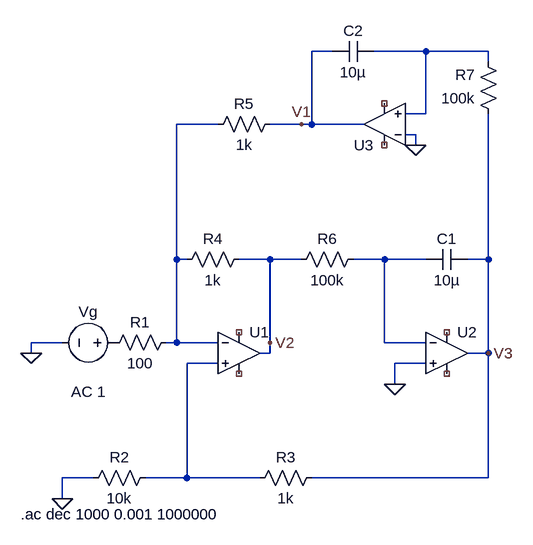
[diagram p0: schematic Draft2.asc]
Draft2.asc, the LTspice schematic file:
Version 4.1
SHEET 1 948 680
WIRE 432 -320 400 -320
WIRE 576 -320 496 -320
WIRE 672 -320 576 -320
WIRE 672 -304 672 -320
WIRE 576 -224 576 -320
WIRE 576 -224 544 -224
WIRE 256 -208 192 -208
WIRE 384 -208 336 -208
WIRE 400 -208 400 -320
WIRE 400 -208 384 -208
WIRE 480 -208 400 -208
WIRE 560 -192 544 -192
WIRE 560 -176 560 -192
WIRE 192 0 192 -208
WIRE 208 0 192 0
WIRE 336 0 288 0
WIRE 384 0 336 0
WIRE 512 0 464 0
WIRE 576 0 512 0
WIRE 672 0 672 -224
WIRE 672 0 640 0
WIRE 16 128 -32 128
WIRE 192 128 192 0
WIRE 192 128 176 128
WIRE 256 128 192 128
WIRE 336 128 336 0
WIRE 512 128 512 0
WIRE 576 128 512 128
WIRE -32 144 -32 128
WIRE 336 144 336 128
WIRE 336 144 320 144
WIRE 672 144 672 0
WIRE 672 144 640 144
WIRE 256 160 208 160
WIRE 576 160 528 160
WIRE 528 192 528 160
WIRE 64 336 16 336
WIRE 208 336 208 160
WIRE 208 336 144 336
WIRE 320 336 208 336
WIRE 672 336 672 144
WIRE 672 336 400 336
WIRE 16 368 16 336
FLAG -32 144 0
FLAG 16 368 0
FLAG 528 192 0
FLAG 560 -176 0
FLAG 384 -208 V1
FLAG 336 128 V2
FLAG 672 144 V3
SYMBOL voltage 112 128 R90
WINDOW 0 -32 56 VBottom 2
WINDOW 3 32 56 VTop 2
WINDOW 123 60 56 VTop 2
WINDOW 39 0 0 Left 0
SYMATTR InstName Vg
SYMATTR Value ""
SYMATTR Value2 AC 1
SYMBOL res 192 112 R90
WINDOW 0 0 56 VBottom 2
WINDOW 3 32 56 VTop 2
SYMATTR InstName R1
SYMATTR Value 100
SYMBOL res 160 320 R90
WINDOW 0 0 56 VBottom 2
WINDOW 3 32 56 VTop 2
SYMATTR InstName R2
SYMATTR Value 10k
SYMBOL res 416 320 R90
WINDOW 0 0 56 VBottom 2
WINDOW 3 32 56 VTop 2
SYMATTR InstName R3
SYMATTR Value 1k
SYMBOL res 304 -16 R90
WINDOW 0 0 56 VBottom 2
WINDOW 3 32 56 VTop 2
SYMATTR InstName R4
SYMATTR Value 1k
SYMBOL res 480 -16 R90
WINDOW 0 0 56 VBottom 2
WINDOW 3 32 56 VTop 2
SYMATTR InstName R6
SYMATTR Value 100k
SYMBOL cap 576 -16 M90
WINDOW 0 0 32 VBottom 2
WINDOW 3 32 32 VTop 2
SYMATTR InstName C1
SYMATTR Value 10µ
SYMBOL res 352 -224 R90
WINDOW 0 0 56 VBottom 2
WINDOW 3 32 56 VTop 2
SYMATTR InstName R5
SYMATTR Value 1k
SYMBOL cap 496 -336 R90
WINDOW 0 0 32 VBottom 2
WINDOW 3 32 32 VTop 2
SYMATTR InstName C2
SYMATTR Value 10µ
SYMBOL res 688 -208 R180
WINDOW 0 36 76 Left 2
WINDOW 3 36 40 Left 2
SYMATTR InstName R7
SYMATTR Value 100k
SYMBOL OpAmps\\UniversalOpAmp1 288 144 R0
SYMATTR InstName U1
SYMBOL OpAmps\\UniversalOpAmp1 608 144 R0
SYMATTR InstName U2
SYMBOL OpAmps\\UniversalOpAmp1 512 -208 R180
SYMATTR InstName U3
TEXT -48 392 Left 2 !.ac dec 1000 0.001 1000000

The netlist it stands for:
* Draft2.asc
Vg P001 0 AC 1
R1 N002 P001 100
R2 N004 0 10k
R3 V3 N004 1k
R4 V2 N002 1k
R6 N003 V2 100k
C1 N003 V3 10µ
R5 V1 N002 1k
C2 N001 V1 10µ
R7 V3 N001 100k
X§U1 N004 N002 NC_01 NC_02 V2 level1 Avol=1Meg GBW=10Meg Vos=0 En=0 Enk=0 In=0 Ink=0 Rin=500Meg  ; pins In+ In- V+ V- OUT
X§U2 0 N003 NC_03 NC_04 V3 level1 Avol=1Meg GBW=10Meg Vos=0 En=0 Enk=0 In=0 Ink=0 Rin=500Meg  ; pins In+ In- V+ V- OUT
X§U3 N001 0 NC_05 NC_06 V1 level1 Avol=1Meg GBW=10Meg Vos=0 En=0 Enk=0 In=0 Ink=0 Rin=500Meg  ; pins In+ In- V+ V- OUT
.ac dec 1000 0.001 1000000
.lib UniversalOpAmp1.lib
.backanno
.end